# EasyEDA schematic LAB03-1_2020-11-16_17-30-34.json
TITLE: Sheet_1; REV: 1.0; Date: 2020-11-16; Sheet: 1/1; Drawn By: ersinalcinn; Company: Your Company
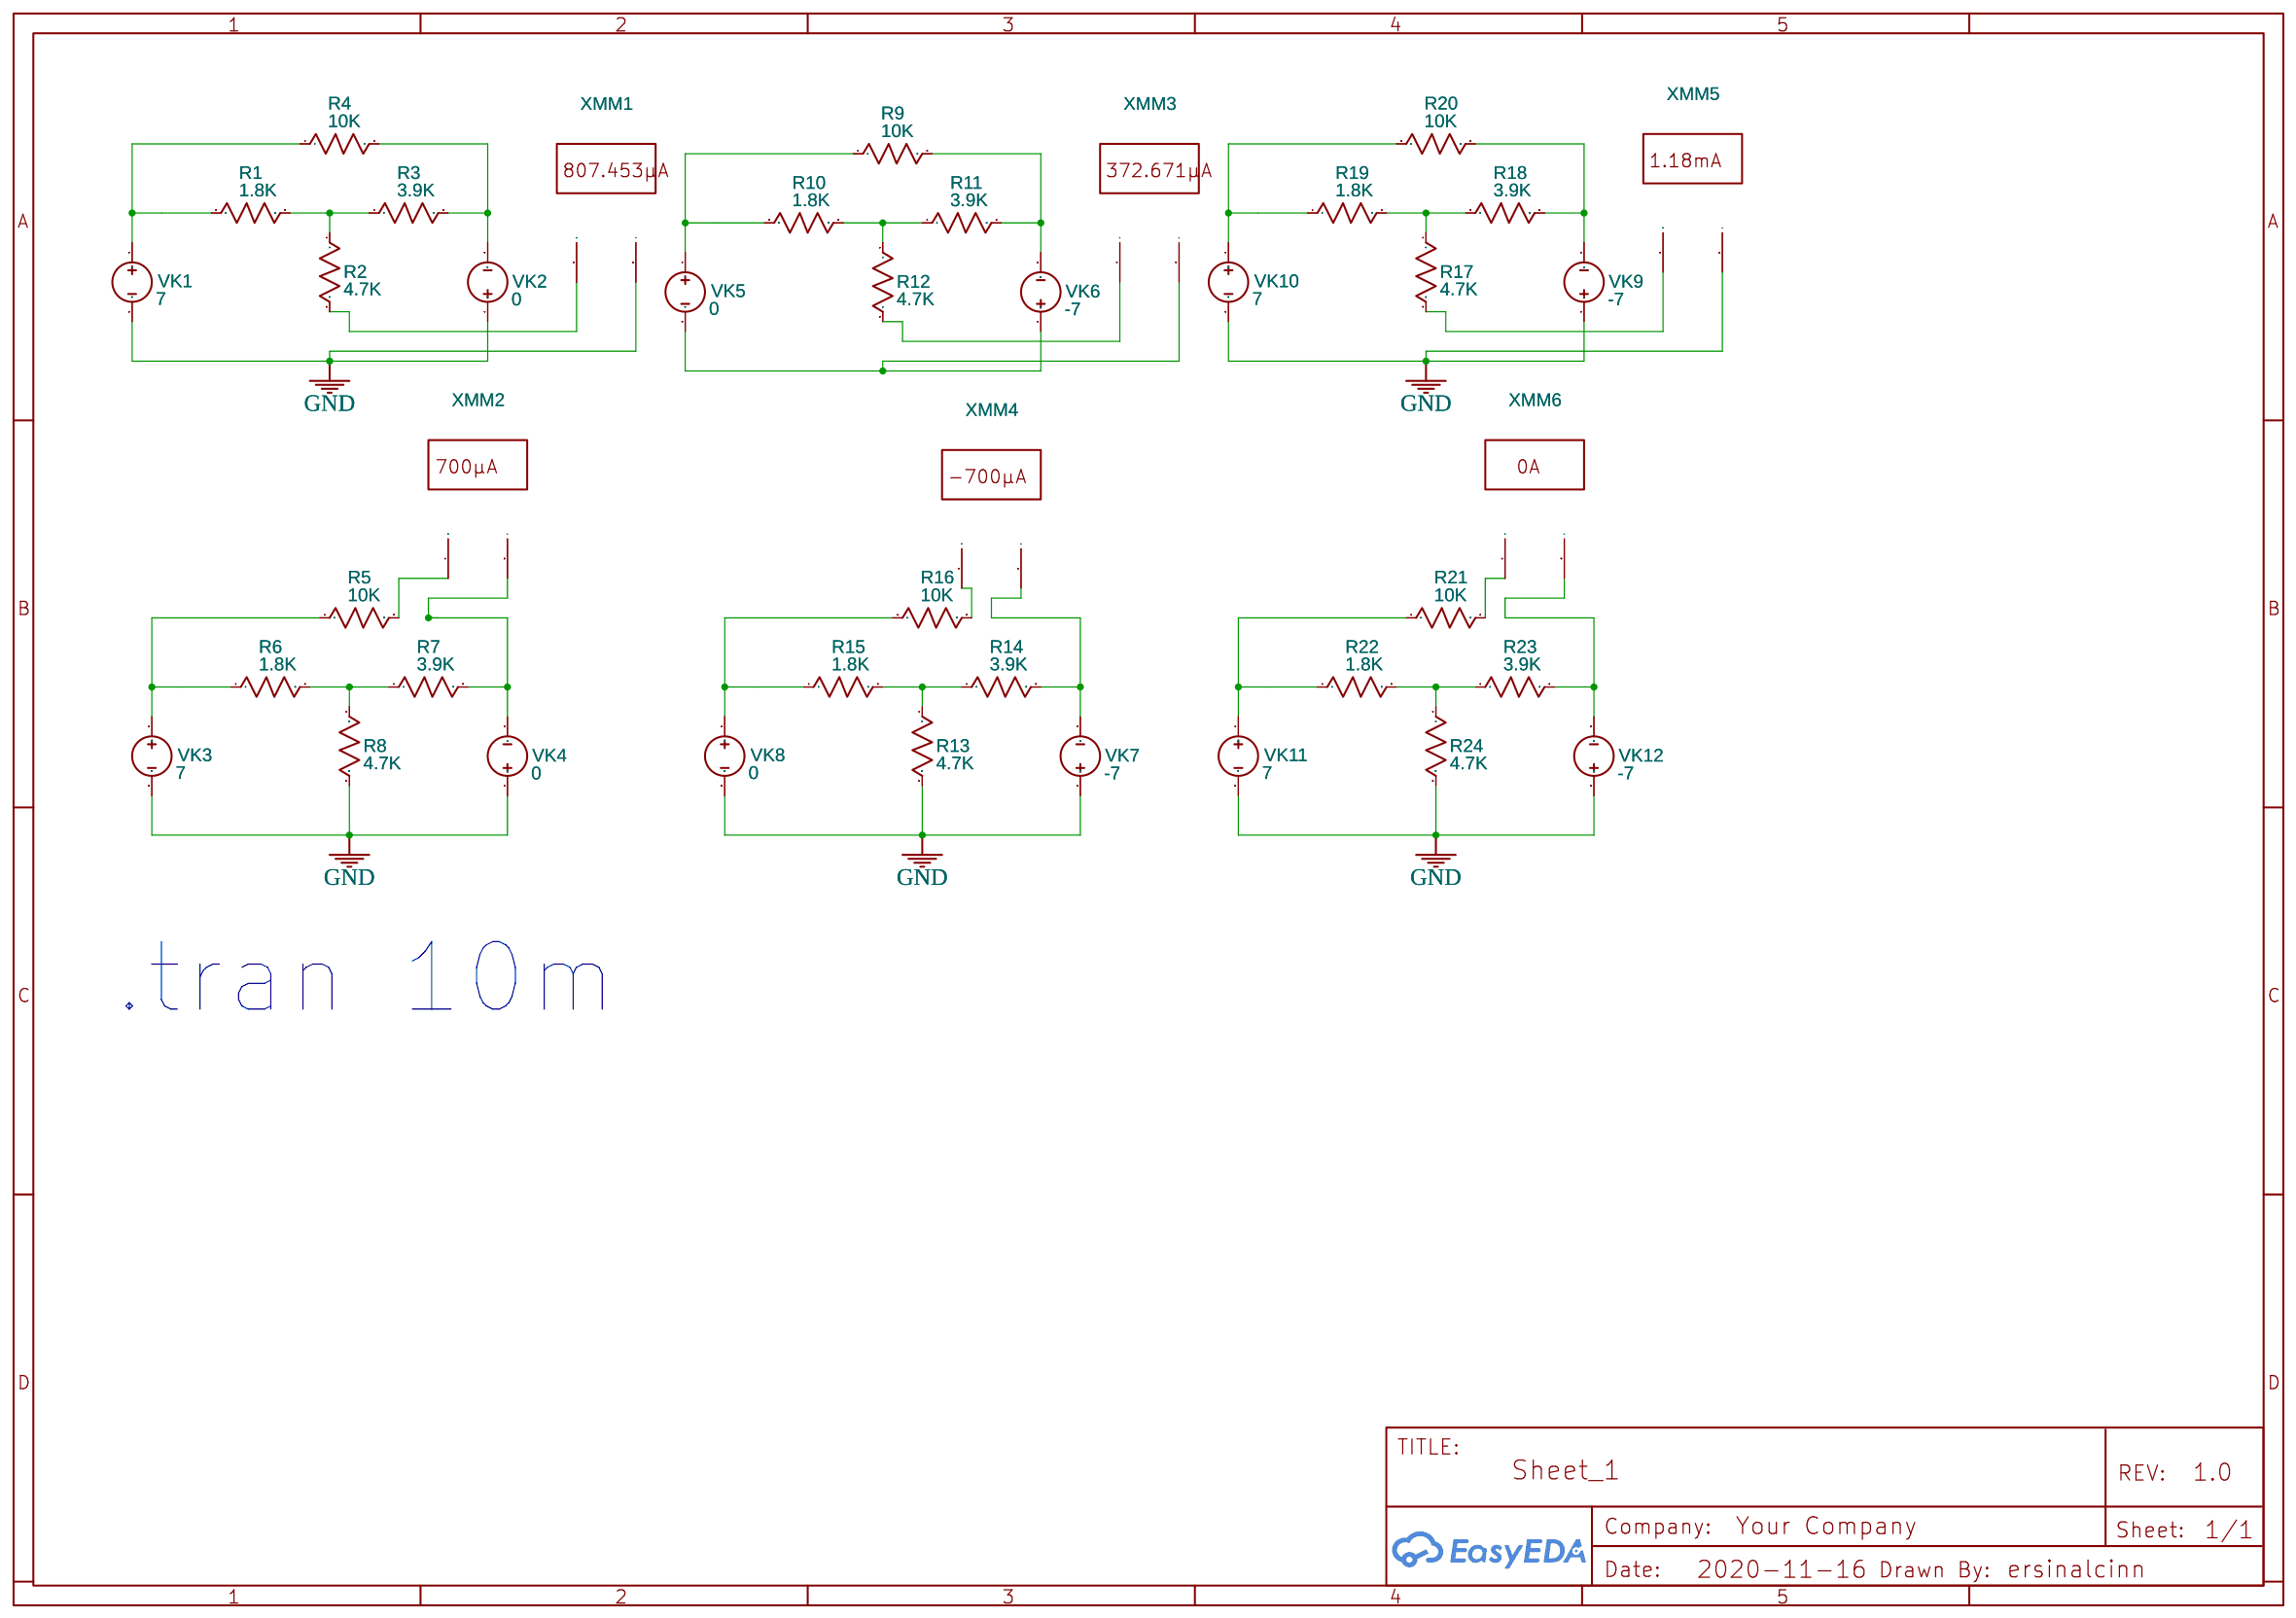
[diagram p0: schematic sheet]

## Parts
R1  1.8K  [AXIAL-0.3]
R2  4.7K  [AXIAL-0.3]
R3  3.9K  [AXIAL-0.3]
R4  10K  [AXIAL-0.3]
R5  10K  [AXIAL-0.3]
R6  1.8K  [AXIAL-0.3]
R7  3.9K  [AXIAL-0.3]
R8  4.7K  [AXIAL-0.3]
R9  10K  [AXIAL-0.3]
R10  1.8K  [AXIAL-0.3]
R11  3.9K  [AXIAL-0.3]
R12  4.7K  [AXIAL-0.3]
R13  4.7K  [AXIAL-0.3]
R14  3.9K  [AXIAL-0.3]
R15  1.8K  [AXIAL-0.3]
R16  10K  [AXIAL-0.3]
R17  4.7K  [AXIAL-0.3]
R18  3.9K  [AXIAL-0.3]
R19  1.8K  [AXIAL-0.3]
R20  10K  [AXIAL-0.3]
R21  10K  [AXIAL-0.3]
R22  1.8K  [AXIAL-0.3]
R23  3.9K  [AXIAL-0.3]
R24  4.7K  [AXIAL-0.3]
VK1  7  [HDR1X2]
VK2  0  [HDR1X2]
VK3  7  [HDR1X2]
VK4  0  [HDR1X2]
VK5  0  [HDR1X2]
VK6  -7  [HDR1X2]
VK7  -7  [HDR1X2]
VK8  0  [HDR1X2]
VK9  -7  [HDR1X2]
VK10  7  [HDR1X2]
VK11  7  [HDR1X2]
VK12  -7  [HDR1X2]
XMM1  Multimeter
XMM2  Multimeter
XMM3  Multimeter
XMM4  Multimeter
XMM5  Multimeter
XMM6  Multimeter

## Library data of the parts
R1-R24 = Resistor_US: Resistance: 1k; Contributor: EasyEDA; Supplier: YUJING
VK1-VK12 = VDC: Contributor: EasyEDA; sim: true
XMM1-XMM6 = MULTIMETER: Supplier: LCSC; Multimeter Type: Amper; Power Type: AC; Voltmeter resistance: 10μ; Ammeter resistance: 1G; NameDisplay: 0; Contributor: EasyEDA; sim: true

## Nets
GND: R8.2 R13.2 R24.2 VK1.2 VK2.1 VK3.2 VK4.1 VK7.1 VK8.2 VK9.1 VK10.2 VK11.2 VK12.1 XMM1.2(I) XMM5.2(I)
Net-(R1-1): R1.1 R4.1 VK1.1
Net-(R1-2): R1.2 R2.1 R3.1
Net-(R2-2): R2.2 XMM1.1(+)
Net-(R3-2): R3.2 R4.2 VK2.2
Net-(R5-1): R5.1 R6.1 VK3.1
Net-(R5-2): R5.2 XMM2.1(+)
Net-(R6-2): R6.2 R7.1 R8.1
Net-(R7-2): R7.2 VK4.2 XMM2.2(I)
Net-(R9-1): R9.1 R10.1 VK5.1
Net-(R9-2): R9.2 R11.2 VK6.2
Net-(R10-2): R10.2 R11.1 R12.1
Net-(R12-2): R12.2 XMM3.1(+)
Net-(R13-1): R13.1 R14.1 R15.2
Net-(R14-2): R14.2 VK7.2 XMM4.2(I)
Net-(R15-1): R15.1 R16.1 VK8.1
Net-(R16-2): R16.2 XMM4.1(+)
Net-(R17-1): R17.1 R18.1 R19.2
Net-(R17-2): R17.2 XMM5.1(+)
Net-(R18-2): R18.2 R20.2 VK9.2
Net-(R19-1): R19.1 R20.1 VK10.1
Net-(R21-1): R21.1 R22.1 VK11.1
Net-(R21-2): R21.2 XMM6.1(+)
Net-(R22-2): R22.2 R23.1 R24.1
Net-(R23-2): R23.2 VK12.2 XMM6.2(I)
Net-(VK5-2): VK5.2 VK6.1 XMM3.2(I)

## Notes on the sheet
- .tran 10m
